# EAGLE design untitled (EAGLE 9.3.2)
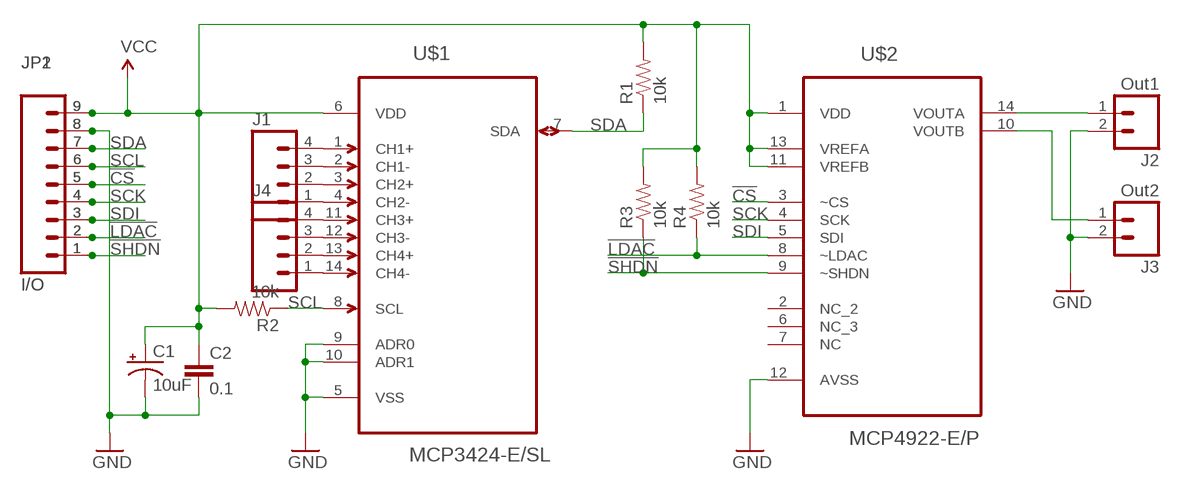
[diagram p0: schematic, sheet 1]

## Parts
C1  10uF  CAP_POLPTH2  [CPOL-RADIAL-10UF-25V]
C2  0.1  CAPPTH1  [CAP-PTH-5MM]
J1  M04LONGPADS  [1X04_LONGPADS]
J2  Out1  M02PTH3  [1X02_LONGPADS]
J3  Out2  M02PTH3  [1X02_LONGPADS]
J4  M04LONGPADS  [1X04_LONGPADS]
JP1  I/O  M09LONGPADS  [1X09_LONGPADS]
JP2  I/O  M09LONGPADS  [1X09_LONGPADS]
R1  10k  RESISTORAXIAL-0.3  [AXIAL-0.3]
R2  10k  RESISTORAXIAL-0.3  [AXIAL-0.3]
R3  10k  RESISTORAXIAL-0.3  [AXIAL-0.3]
R4  10k  RESISTORAXIAL-0.3  [AXIAL-0.3]
U$1  MCP3424-E/SL  [SOIC127P600X175-14N]
U$2  MCP4922-E/P  [DIP254P762X533-14]

## Nets
!CS: JP1.5 JP2.5 U$2.3(~CS)
!LDAC: JP1.2 JP2.2 R4.P$1 U$2.8(~LDAC)
!SHDN: JP1.1 JP2.1 R3.P$1 U$2.9(~SHDN)
GND: C1.2(-) C2.2 J2.2 J3.2 JP1.8 JP2.8 U$1.5(VSS) U$1.9(ADR0) U$1.10(ADR1) U$2.12(AVSS)
N$1: J1.1 U$1.4(CH2-)
N$2: J1.2 U$1.3(CH2+)
N$3: J1.3 U$1.2(CH1-)
N$4: J1.4 U$1.1(CH1+)
N$5: J4.1 U$1.14(CH4-)
N$6: J4.2 U$1.13(CH4+)
N$7: J4.3 U$1.12(CH3-)
N$8: J4.4 U$1.11(CH3+)
N$10: J2.1 U$2.14(VOUTA)
N$11: J3.1 U$2.10(VOUTB)
SCK: JP1.4 JP2.4 U$2.4(SCK)
SCL: JP1.6 JP2.6 R2.P$1 U$1.8(SCL)
SDA: JP1.7 JP2.7 R1.P$1 U$1.7(SDA)
SDI: JP1.3 JP2.3 U$2.5(SDI)
VCC: C1.1(+) C2.1 JP1.9 JP2.9 R1.P$2 R2.P$2 R3.P$2 R4.P$2 U$1.6(VDD) U$2.1(VDD) U$2.11(VREFB) U$2.13(VREFA)
Unconnected: U$2.2(NC_2) U$2.6(NC_3) U$2.7(NC)

## Library data of the parts
C1 = SparkFun-Passives:CAP_POL: Capacitor Polarized These are standard SMD and PTH capacitors. Normally 10uF, 47uF, and 100uF in electrolytic and tantalum varieties. Always verify the external diameter of the through hole cap, it varies with capacity, voltage, and manufacturer. The EIA devices should be standard.
C2 = SparkFun-Passives:CAP: Capacitor Standard 0603 ceramic capacitor, and 0.1" leaded capacitor.
J1 J4 = SparkFun-Connectors:M04: Header 4 Standard 4-pin 0.1" header. Use with straight break away headers (SKU : PRT-00116), right angle break away headers (PRT-00553), swiss pins (PRT-00743), machine pins (PRT-00117), and female headers (PRT-00115). Molex polarized connector foot print use with SKU : PRT-08231 with associated crimp pins and housings. 1MM SMD Version SKU: PRT-10208; PROD_ID: CONN-09696
J2 J3 = SparkFun-Connectors:M02: Standard 2-pin 0.1" header. Use with - straight break away headers ( PRT-00116) - right angle break away headers (PRT-00553) - swiss pins (PRT-00743) - machine pins (PRT-00117) - female headers (PRT-00115) Molex polarized connector foot print use with: PRT-08233 with associated crimp pins and housings. 2.54_SCREWTERM for use with PRT-10571. 3.5mm Screw Terminal footprints for PRT-08084 5mm Screw Terminal footprints for use with PRT-08432
JP1 JP2 = SparkFun:M09: Header 9 Standard 9-pin 0.1" header. Use with straight break away headers (SKU : PRT-00116), right angle break away headers (PRT-00553), swiss pins (PRT-00743), machine pins (PRT-00117), and female headers (PRT-00115).
R1-R4 = SparkFun-Passives:RESISTOR: Resistor Basic schematic elements and footprints for 0603, 1206, and PTH resistors.
U$1 = Microchip_By_element14_Batch_1:MCP3424-E/SL: Analog-to-Digital Converter; MPN: MCP3424-E/SL; OC_FARNELL: 1630424; OC_NEWARK: 54M4871; PACKAGE: SOIC-14; SUPPLIER: Microchip
U$2 = Microchip_By_element14_Batch_1:MCP4922-E/P: 12-Bit DAC; MPN: MCP4922-E/P; OC_FARNELL: 1292244; OC_NEWARK: 61K2950; PACKAGE: DIP-14; SUPPLIER: Microchip

## Board
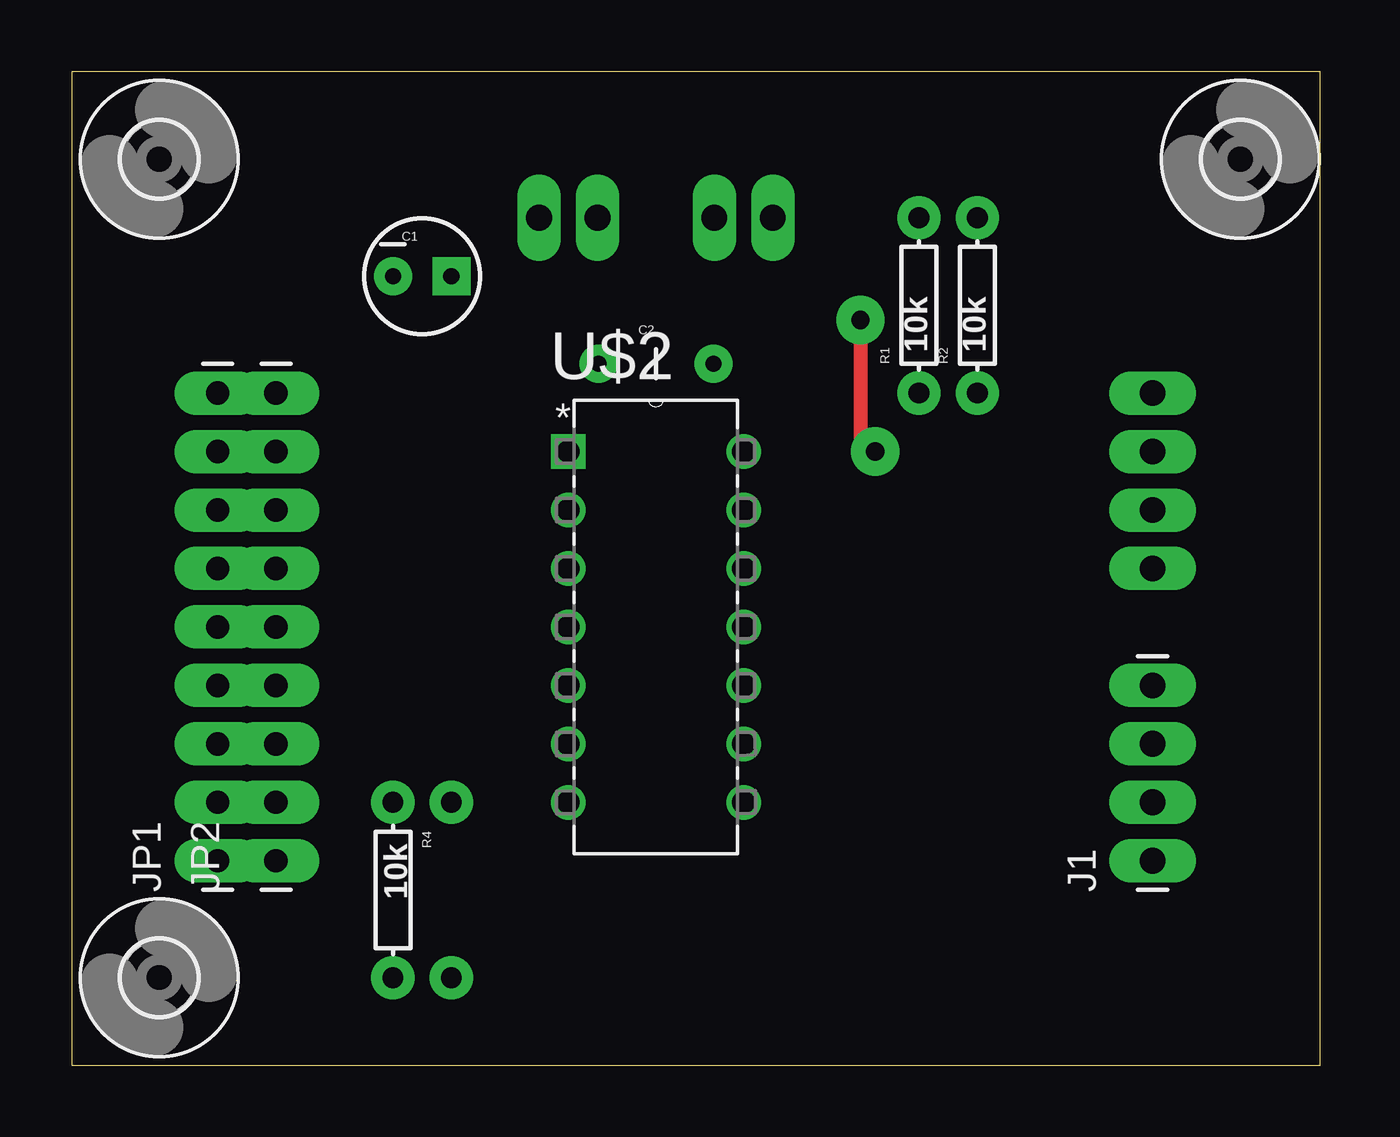
[diagram p1: board, top side]
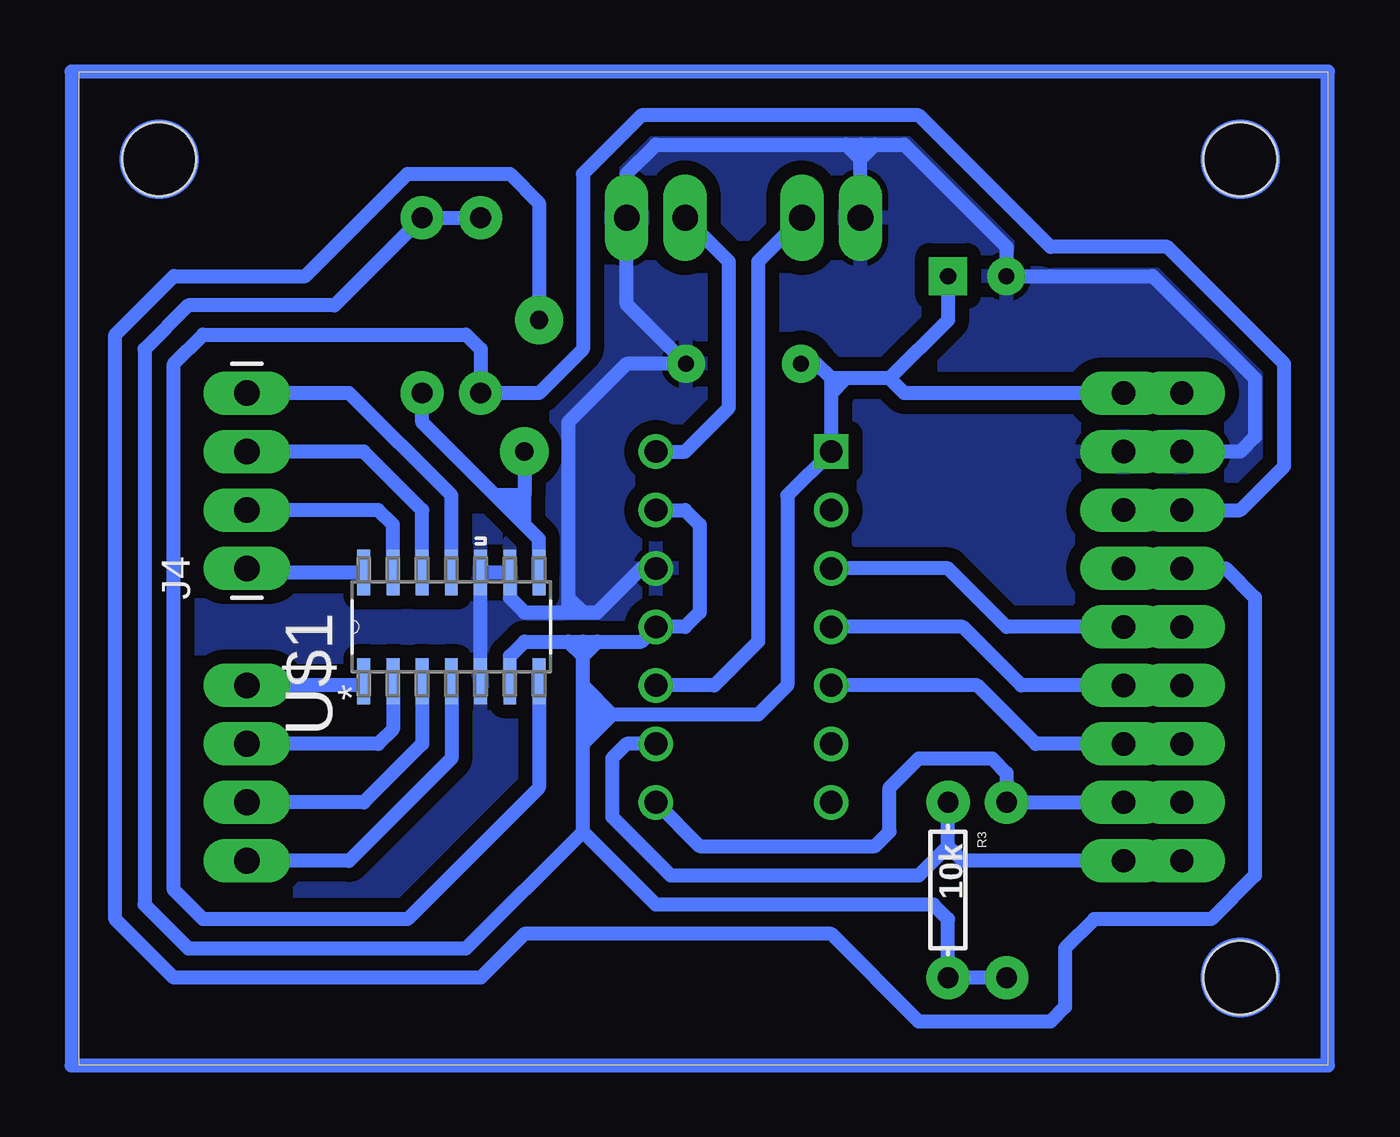
[diagram p2: board, bottom side, seen from below]

Size 54.28 x 43.17 mm. Coordinates in mm from the lower left corner, seen from the top.
Outline: 0,0 54.28,0 54.28,43.17 0,43.17 0,0
Copper layers (1*16): Top 0.035mm / dielectric 1.5mm / Bottom 0.035mm
Design rules "default": minimum track width 6mil, minimum drill 0.35mm, track to track 6mil, track to pad 6mil, pad to pad 6mil, via to via 6mil, smd to smd 6mil, copper to edge 40mil, drill to drill 6mil, minimum pad ring 10mil, minimum via ring 8mil, stop-mask expansion 4mil, vias tented up to drill 0mil, thermal gap 10mil

### Footprints (pad centres in the part's own frame; a part is rotated, then mirrored left to right if it is on the bottom)
CPOL-RADIAL-10UF-25V = drill 0.7 pad 1.651 square: 1 1.27,0 | drill 0.7 pad 1.651: 2 -1.27,0
CAP-PTH-5MM = drill 0.7 pad 1.651: 1 -2.5,0; 2 2.5,0
1X04_LONGPADS = drill 1.118 pad 1.88 long: 1 0,0; 2 2.54,0; 3 5.08,0; 4 7.62,0
1X02_LONGPADS = drill 1.118 pad 1.88 long: 1 0,0; 2 2.54,0
1X09_LONGPADS = drill 1.016 pad 1.88 long: 1 0,0; 2 2.54,0; 3 5.08,0; 4 7.62,0; 5 10.16,0; 6 12.7,0; 7 15.24,0; 8 17.78,0; 9 20.32,0
AXIAL-0.3 = drill 0.9 pad 1.88: P$1 -3.81,0; P$2 3.81,0
SOIC127P600X175-14N = smd 1.981 x 0.559: 1 -2.362,3.81; 2 -2.362,2.54; 3 -2.362,1.27; 4 -2.362,0; 5 -2.362,-1.27; 6 -2.362,-2.54; 7 -2.362,-3.81; 8 2.362,-3.81; 9 2.362,-2.54; 10 2.362,-1.27; 11 2.362,0; 12 2.362,1.27; 13 2.362,2.54; 14 2.362,3.81
DIP254P762X533-14 = drill 0.991 square: 1 -7.62,15.24 | drill 0.991: 2 -7.62,12.7; 3 -7.62,10.16; 4 -7.62,7.62; 5 -7.62,5.08; 6 -7.62,2.54; 7 -7.62,0; 8 0,0; 9 0,2.54; 10 0,5.08; 11 0,7.62; 12 0,10.16; 13 0,12.7; 14 0,15.24
3,2 = hole 3.2: 0,0

### Placement (x,y rotation side)
C1  15.24,34.29 0 top
C2  25.4,30.48 0 top
J1  46.99,8.89 90 top
J2  27.94,36.83 0 top
J3  22.86,36.83 180 top
J4  46.99,21.59 90 bottom
JP1  6.35,8.89 90 top
JP2  8.89,8.89 90 top
R1  36.83,33.02 90 top
R2  39.37,33.02 90 top
R3  16.51,7.62 270 bottom
R4  13.97,7.62 270 top
U$1  38.1,19.05 90 bottom
U$2  29.21,11.43 0 top
U$3  [3,2]  3.81,39.37 0 top
U$4  [3,2]  50.8,39.37 0 top
U$5  [3,2]  3.81,3.81 0 top

### Tracks (layer width: path | path; a pad name or v marks a point on that pad's centre or on a via)
!CS
  Bottom 0.61: JP1.5 JP2.5 13.97,19.05 16.51,21.59 U$2.3
!LDAC
  Bottom 0.61: JP1.2 JP2.2 R4.P$1 13.97,12.7 14.61,13.33 17.78,13.33 19.05,12.06 19.05,10.16 19.68,9.53 27.31,9.53 U$2.8
!SHDN
  Bottom 0.61: JP1.1 JP2.1 15.88,8.89 16.51,9.53 | 16.51,9.53 R3.P$1 | U$2.9 30.48,13.97 31.11,13.33 31.11,10.79 28.57,8.26 17.78,8.26 16.51,9.53
GND
  Bottom 0.61: JP2.8 JP1.8 3.81,26.67 3.18,27.3 3.18,29.84 6.35,33.02 7.62,34.29 C1.2 13.97,35.56 18.41,40 19.68,40 | U$1.5 U$1.10 U$1.9 35.56,20.32 34.92,19.69 33.02,19.69 | U$2.12 29.85,21.59 31.75,19.69 32.39,19.69 | 33.02,19.69 32.39,19.69 | 20.95,40 29.21,40 30.48,38.73 J2.2 30.48,33.06 C2.2 30.48,30.48 33.02,27.94 33.02,20.32 | 20.95,40 20.32,40 | 20.32,40 19.68,40 | J3.2 20.32,39.37 | 20.32,39.37 20.32,40 | 33.02,20.32 33.02,19.69 | 19.68,40 20.32,39.37 | 20.32,39.37 20.95,40 | 33.02,20.32 32.39,19.69
  pour Bottom (isolate 0.61): 0,43.18 54.61,43.18 54.61,0 0,0
N$1
  Bottom 0.61: U$1.4 38.1,13.33 42.55,8.89 J1.1
N$2
  Bottom 0.61: U$1.3 39.37,13.97 41.91,11.43 J1.2
N$3
  Bottom 0.61: U$1.2 40.64,14.6 41.28,13.97 J1.3
N$4
  Bottom 0.61: U$1.1 42.09,16.51 J1.4
N$5
  Bottom 0.61: U$1.14 46.81,21.41 J4.1
N$6
  Bottom 0.61: U$1.13 40.64,23.49 41.28,24.13 J4.2
N$7
  Bottom 0.61: U$1.12 39.37,24.13 41.91,26.67 J4.3
N$8
  Bottom 0.61: U$1.11 38.1,24.77 42.55,29.21 J4.4
N$9
  Bottom 0.61: 0,43.18 54.61,43.18 54.61,0 0,0 0,43.18
N$10
  Bottom 0.61: J2.1 26.04,34.92 26.04,28.57 27.94,26.67 U$2.14
N$11
  Bottom 0.61: J3.1 24.76,34.92 24.76,18.41 26.67,16.51 U$2.10
SCK
  Bottom 0.61: JP1.4 JP2.4 13.34,16.51 15.88,19.05 U$2.4
SCL  (via drill 0.8 pad 2.1)
  Top 0.61: v34.29,32.38 34.29,27.3 v34.92,26.67
  Bottom 0.61: JP2.6 JP1.6 4.45,21.59 3.18,20.32 3.18,8.26 5.08,6.35 10.16,6.35 11.43,5.08 11.43,2.54 12.07,1.91 17.78,1.91 21.59,5.71 34.92,5.71 36.83,3.81 50.17,3.81 52.7,6.35 52.7,31.75 50.17,34.29 44.45,34.29 40,38.73 35.56,38.73 34.29,37.46 v34.29,32.38 | U$1.8 34.29,22.86 34.92,23.49 | 34.92,23.49 35.56,24.13 | 35.56,24.13 36.19,24.77 | 36.19,24.77 39.37,27.94 R2.P$1 | v34.92,26.67 34.92,24.77 | 34.92,24.77 35.56,24.13 | 34.92,23.49 34.92,24.77 | 34.92,24.77 36.19,24.77
SDA
  Bottom 0.61: JP1.7 JP2.7 3.81,24.13 1.9,26.03 1.9,30.48 6.98,35.56 12.07,35.56 17.78,41.27 29.85,41.27 32.39,38.73 32.39,31.12 34.29,29.21 R1.P$1 36.83,31.12 37.47,31.75 48.89,31.75 50.17,30.48 50.17,7.62 48.89,6.35 40,6.35 34.29,12.06 U$1.7
SDI
  Bottom 0.61: JP2.3 JP1.3 12.7,13.97 15.24,16.51 U$2.5
VCC
  Bottom 0.406: 31.75,15.24 32.39,15.24 | 32.39,15.88 31.75,15.24 | 31.75,15.24 32.39,14.6
  Bottom 0.61: JP1.9 JP2.9 18.41,29.21 19.05,29.84 | U$1.6 35.56,17.78 34.92,18.41 33.02,18.41 | 33.02,18.41 32.39,18.41 | 32.39,18.41 31.75,18.41 | 31.75,18.41 29.85,18.41 U$2.11 27.94,19.05 27.31,19.69 27.31,23.49 27.94,24.13 U$2.13 | R1.P$2 R2.P$2 43.18,33.02 49.53,33.02 51.44,31.12 51.44,6.99 49.53,5.08 37.47,5.08 32.39,10.16 | 21.59,29.21 U$2.1 23.5,24.77 23.5,16.51 24.76,15.24 31.11,15.24 | 21.59,29.21 21.59,29.84 | 21.59,29.84 22.22,30.48 C2.1 | C1.1 16.51,32.38 19.05,29.84 | 19.05,29.84 20.95,29.84 | 20.95,29.84 21.59,29.84 | R4.P$2 R3.P$2 16.51,6.35 17.14,6.99 29.21,6.99 32.39,10.16 | 32.39,10.16 32.39,13.97 | 32.39,13.97 32.39,14.6 32.39,15.24 32.39,15.88 32.39,16.51 | 32.39,16.51 32.39,17.78 | 32.39,17.78 32.39,18.41 | 31.11,15.24 31.75,15.24 | 21.59,29.21 20.95,29.84 | 32.39,16.51 31.11,15.24 | 31.11,15.24 32.39,13.97 | 31.75,18.41 32.39,17.78 | 32.39,17.78 33.02,18.41
(copper drawn outside any net)
  shapes: Bottom circle x3